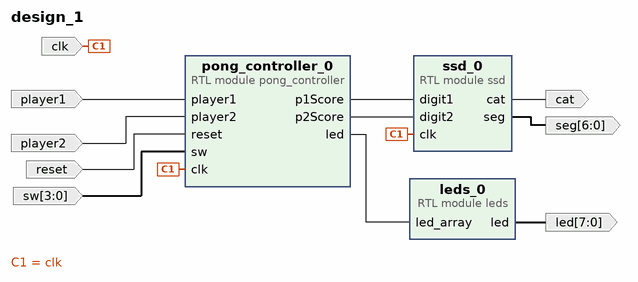
[diagram p0: block diagram of the top level]
# Vivado block design design_1, xc7z010clg400-1, Vivado 2021.2
create_bd_design design_1

create_bd_port -dir I -type clk clk
set_property -dict {CONFIG.FREQ_HZ 125000000} [get_bd_ports clk]
create_bd_port -dir I -type rst reset
set_property -dict {CONFIG.POLARITY ACTIVE_HIGH} [get_bd_ports reset]
create_bd_port -dir I player1
create_bd_port -dir I player2
create_bd_port -dir I -from 3 -to 0 sw
create_bd_port -dir O cat
create_bd_port -dir O -from 6 -to 0 seg
create_bd_port -dir O -from 7 -to 0 led

create_bd_cell -type module -reference leds leds_0
create_bd_cell -type module -reference ssd ssd_0
create_bd_cell -type module -reference pong_controller pong_controller_0

# ---- connections ----

connect_bd_net [get_bd_ports clk] [get_bd_pins pong_controller_0/clk] [get_bd_pins ssd_0/clk]
connect_bd_net [get_bd_pins leds_0/led] [get_bd_ports led]
connect_bd_net -net player1_1 [get_bd_ports player1] [get_bd_pins pong_controller_0/player1]
connect_bd_net -net player2_1 [get_bd_ports player2] [get_bd_pins pong_controller_0/player2]
connect_bd_net [get_bd_pins pong_controller_0/led] [get_bd_pins leds_0/led_array]
connect_bd_net [get_bd_pins pong_controller_0/p1Score] [get_bd_pins ssd_0/digit1]
connect_bd_net [get_bd_pins pong_controller_0/p2Score] [get_bd_pins ssd_0/digit2]
connect_bd_net [get_bd_ports reset] [get_bd_pins pong_controller_0/reset]
connect_bd_net [get_bd_pins ssd_0/cat] [get_bd_ports cat]
connect_bd_net [get_bd_pins ssd_0/seg] [get_bd_ports seg]
connect_bd_net [get_bd_ports sw] [get_bd_pins pong_controller_0/sw]

validate_bd_design
save_bd_design
